# EAGLE design VNH2SP30 (EAGLE 7.2.0)
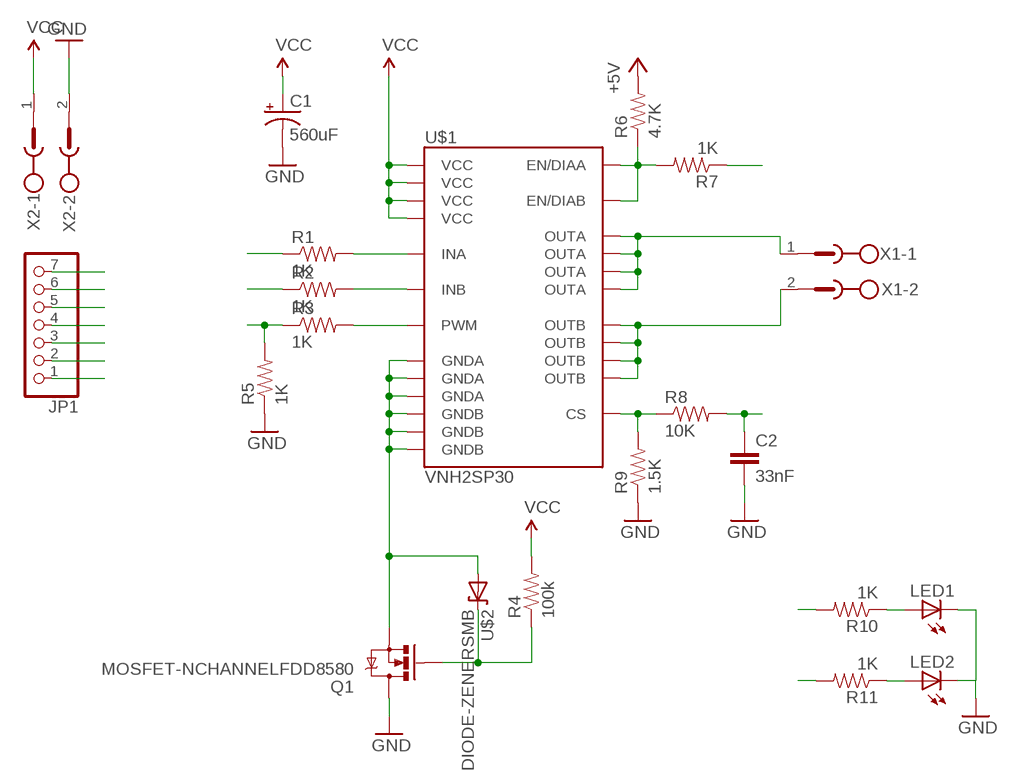
[diagram p0: schematic, sheet 1]

## Parts
C1  560uF  CAP_POLG  [PANASONIC_G]
C2  33nF  CAP1206  [1206]
JP1  PINHD-1X7  [1X07]
LED1  LEDCHIPLED_1206  [CHIPLED_1206]
LED2  LEDCHIPLED_1206  [CHIPLED_1206]
Q1  MOSFET-NCHANNELFDD8580  [DPAK]
R1  1K  RESISTOR1206  [1206]
R2  1K  RESISTOR1206  [1206]
R3  1K  RESISTOR1206  [1206]
R4  100k  RESISTOR1206  [1206]
R5  1K  RESISTOR1206  [1206]
R6  4.7K  RESISTOR1206  [1206]
R7  1K  RESISTOR1206  [1206]
R8  10K  RESISTOR1206  [1206]
R9  1.5K  RESISTOR1206  [1206]
R10  1K  RESISTOR1206  [1206]
R11  1K  RESISTOR1206  [1206]
U$1  VNH2SP30  [VNH2SP30]
U$2  DIODE-ZENERSMB  [SMB-DIODE]
X1  MSTBV2  [MSTBV2]
X2  MSTBV2  [MSTBV2]

## Nets
+5V: JP1.7 R6.2
CS: C2.1 JP1.2 R8.2
EN: JP1.6 R7.1
GND: C1.- C2.2 JP1.1 LED1.C LED2.C Q1.4(D) R5.1 R9.1 X2.2
INA: JP1.5 R1.1
INB: JP1.4 R2.1
N$2: Q1.3(S) U$1.18(GNDB) U$1.19(GNDB) U$1.20(GNDB) U$1.26(GNDA) U$1.27(GNDA) U$1.28(GNDA) U$2.A
N$3: R1.2 U$1.5(INA)
N$4: R2.2 U$1.11(INB)
N$5: R3.2 U$1.8(PWM)
N$6: Q1.1(G) R4.1 U$2.C
N$11: R8.1 R9.2 U$1.9(CS)
N$12: R6.1 R7.2 U$1.6(EN/DIAA) U$1.10(EN/DIAB)
N$32: LED2.A R11.1
N$34: LED1.A R10.1
OUTA: R11.2 U$1.1(OUTA) U$1.25(OUTA) U$1.30(OUTA) U$1.SLUG3(OUTA) X1.1
OUTB: R10.2 U$1.15(OUTB) U$1.16(OUTB) U$1.21(OUTB) U$1.SLUG2(OUTB) X1.2
PWM: JP1.3 R3.1 R5.2
VCC: C1.+ R4.2 U$1.3(VCC) U$1.13(VCC) U$1.23(VCC) U$1.SLUG1(VCC) X2.1

## Library data of the parts
C1 = SparkFun:CAP_POL: Capacitor Polarized These are standard SMD and PTH capacitors. Normally 10uF, 47uF, and 100uF in electrolytic and tantalum varieties. Always verify the external diameter of the through hole cap, it varies with capacity, voltage, and manufacturer. The EIA devices should be standard.
C2 = SparkFun:CAP: Capacitor Standard 0603 ceramic capacitor, and 0.1" leaded capacitor.
JP1 = pinhead:PINHD-1X7: PIN HEADER
LED1 LED2 = led:LED: LED OSRAM: - CHIPLED LG R971, LG N971, LY N971, LG Q971, LY Q971, LO R971, LY R971 LH N974, LH R974 LS Q976, LO Q976, LY Q976 LO Q996 - Hyper CHIPLED LW Q18S LB Q993, LB Q99A, LB R99A - SideLED LS A670, LO A670, LY A670, LG A670, LP A670 LB A673, LV A673, LT A673, LW A673 LH A674 LY A675 LS A676, LA A676, LO A676, LY A676, LW A676 LS A679, LY A679, LG A679 - Hyper Micro SIDELED® LS Y876, LA Y876, LO Y876, LY Y876 LT Y87S - SmartLED LW L88C, LW L88S LB L89C, LB L89S, LG L890 LS L89K, LO L89K, LY L89K LS L896, LA L896, LO L896, LY L896 - TOPLED LS T670, LO T670, LY T670, LG T670, LP T670 LSG T670, LSP T670, LSY T670, LOP T670, LYG T670 LG T671, LOG T671, LSG T671 LB T673, LV T673, LT T673, LW T673 LH T674 LS T676, LA T676, LO T676, LY T676, LB T676, LH T676, LSB T676, LW T676 LB T67C, LV T67C, LT T67C, LS T67K, LO T67K, LY T67K, LW E67C LS E67B, LA E67B, LO E67B, LY E67B, LB E67C, LV E67C, LT E67C LW T67C LS T679, LY T679, LG T679 LS T770, LO T770, LY T770, LG T770, LP T770 LB T773, LV T773, LT T773, LW T773 LH T774 LS E675, LA E675, LY E675, LS T675 LS T776, LA T776, LO T776, LY T776, LB T776 LHGB T686 LT T68C, LB T68C - Hyper Mini TOPLED® LB M676 - Mini TOPLED Santana® LG M470 LS M47K, LO M47K, LY M47K Source: http://www.osram.convergy.de LUXEON: - LUMILED® LXK2-PW12-R00, LXK2-PW12-S00, LXK2-PW14-U00, LXK2-PW14-V00 LXK2-PM12-R00, LXK2-PM12-S00, LXK2-PM14-U00 LXK2-PE12-Q00, LXK2-PE12-R00, LXK2-PE12-S00, LXK2-PE14-T00, LXK2-PE14-U00 LXK2-PB12-K00, LXK2-PB12-L00, LXK2-PB12-M00, LXK2-PB14-N00, LXK2-PB14-P00, LXK2-PB14-Q00 LXK2-PR12-L00, LXK2-PR12-M00, LXK2-PR14-Q00, LXK2-PR14-R00 LXK2-PD12-Q00, LXK2-PD12-R00, LXK2-PD12-S00 LXK2-PH12-R00, LXK2-PH12-S00 LXK2-PL12-P00, LXK2-PL12-Q00, LXK2-PL12-R00 Source: www.luxeon.com KINGBRIGHT: KA-3528ASYC Source: www.kingbright.com
Q1 = SparkFun:MOSFET-NCHANNEL
R1-R11 = SparkFun:RESISTOR: Resistor Basic schematic elements and footprints for 0603, 1206, and PTH 1/10th watt (small) resistors.
U$1 = SparkFun:VNH2SP30
U$2 = SparkFun:DIODE-ZENER: Zener Diode Production Part - 8199 3.4V Zener Voltage
X1 X2 = con-phoenix-500:MSTBV2: PHOENIX; OC_FARNELL: unknown; OC_NEWARK: unknown

## Board
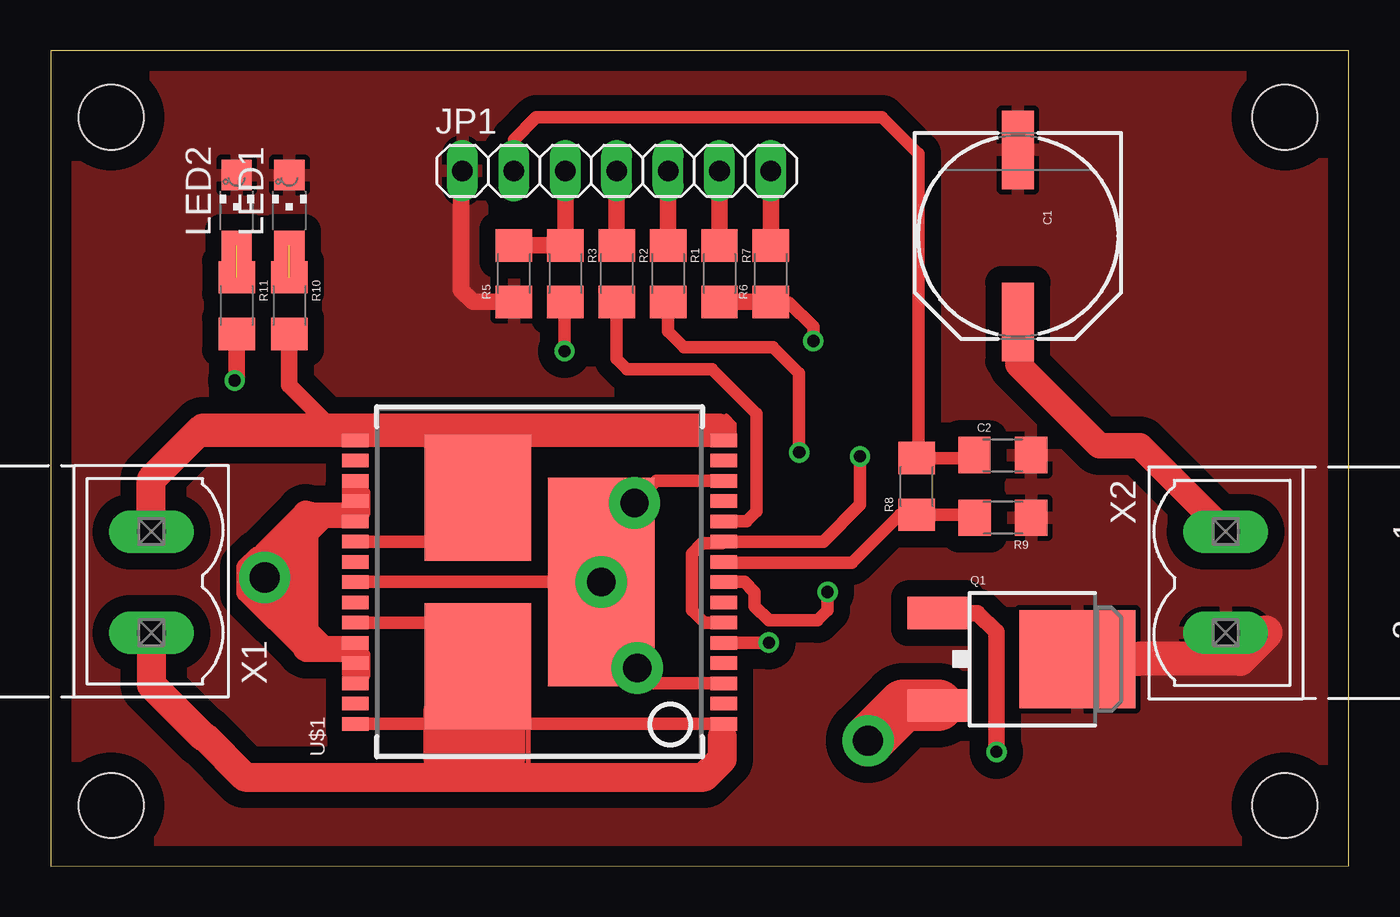
[diagram p1: board, top side]
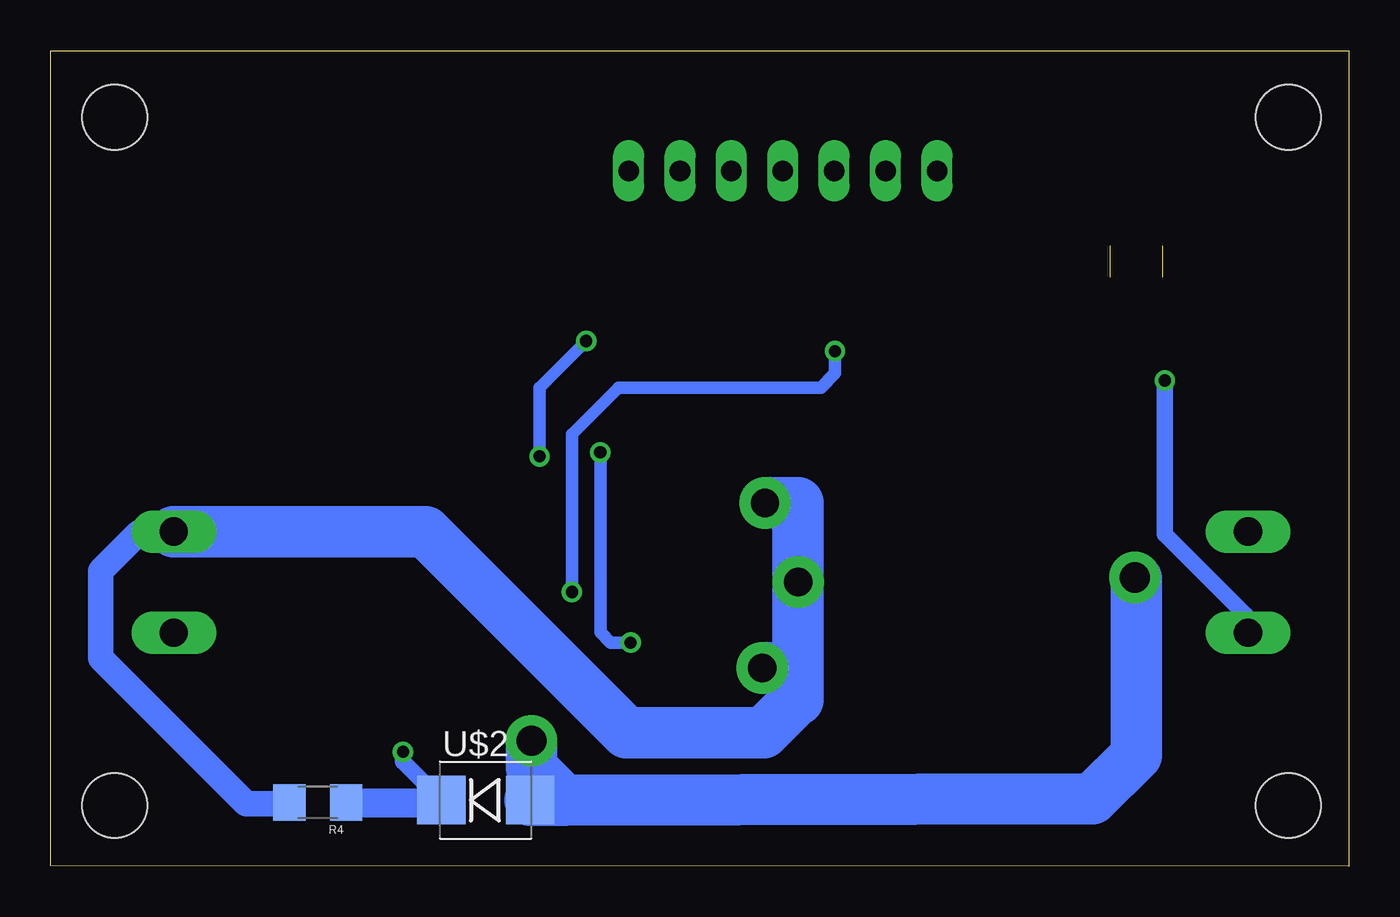
[diagram p2: board, bottom side, seen from below]

Size 64.17 x 40.3 mm. Coordinates in mm from the lower left corner, seen from the top.
Outline: 0,0 64.17,0.02 64.17,40.3 0,40.29 0,0
Copper layers (1*16): Top 0.035mm / dielectric 1.5mm / Bottom 0.035mm
Design rules "default": minimum track width 10mil, minimum drill 24mil, track to track 8mil, track to pad 8mil, pad to pad 8mil, via to via 8mil, smd to smd 8mil, copper to edge 40mil, drill to drill 8mil, minimum pad ring 10mil, minimum via ring 8mil, stop-mask expansion 4mil, vias tented up to drill 0mil, thermal gap 10mil
Holes 3.2 mm at 3,3 3,37 61,37 61,3

### Footprints (pad centres in the part's own frame; a part is rotated, then mirrored left to right if it is on the bottom)
PANASONIC_G = smd 3.9 x 1.6: + 4.25,0; - -4.25,0
1206 = smd 1.6 x 1.8: 1 -1.4,0; 2 1.4,0
1X07 = drill 1.016 long: 1 -7.62,0; 2 -5.08,0; 3 -2.54,0; 4 0,0; 5 2.54,0; 6 5.08,0; 7 7.62,0
CHIPLED_1206 = smd 1.5 x 1.5: A 0,-1.75; C 0,1.75
DPAK = smd 1.6 x 3: 1 -2.28,-5.31; 3 2.28,-5.31 | smd 4.826 x 5.715: 4 0,1.588
VNH2SP30 = smd 0.67 x 1.3: 1 -7,-9.1; 2 -6,-9.1; 3 -5,-9.1; 4 -4,-9.1; 5 -3,-9.1; 6 -2,-9.1; 7 -1,-9.1; 8 0,-9.1; 9 1,-9.1; 10 2,-9.1; 11 3,-9.1; 12 4,-9.1; 13 5,-9.1; 14 6,-9.1; 15 7,-9.1; 16 7,9.1; 17 6,9.1; 18 5,9.1; 19 4,9.1; 20 3,9.1; 21 2,9.1; 22 1,9.1; 23 0,9.1; 24 -1,9.1; 25 -2,9.1; 26 -3,9.1; 27 -4,9.1; 28 -5,9.1; 29 -6,9.1; 30 -7,9.1 | smd 10.3 x 5.25: SLUG1 0,-3.05 | smd 6.23 x 5.25: SLUG2 4.165,3.05; SLUG3 -4.165,3.05
SMB-DIODE = smd 2.4 x 2.4: A 2.2,0; C -2.2,0
MSTBV2 = drill 1.397 long: 1 -2.5,0; 2 2.5,0

### Placement (x,y rotation side)
C1  47.81,31.14 270 top
C2  47.06,20.31 0 top
JP1  27.98,34.36 0 top
LED1  11.8,32.4 0 top
LED2  9.2,32.4 0 top
Q1  49.16,10.23 270 top
R1  30.52,29.28 270 top
R2  27.98,29.28 270 top
R3  25.44,29.28 270 top
R4  50.96,3.15 180 bottom
R5  22.9,29.28 90 top
R6  35.6,29.28 90 top
R7  33.06,29.28 270 top
R8  42.8,18.77 90 top
R9  47.07,17.22 180 top
R10  11.8,27.7 270 top
R11  9.2,27.7 270 top
U$1  24.17,14.04 90 top
U$2  42.66,3.27 0 bottom
X1  4.98,14.04 90 top
X2  58.08,14.04 270 top

### Tracks (layer width: path | path; a pad name or v marks a point on that pad's centre or on a via)
+5V
  Top 0.813: JP1.7 R6.2
CS
  Top 0.61: JP1.2 22.9,35.9 24,37 41.1,37 42.9,35.2 42.9,20.27 R8.2 45.52,20.17 C2.1
EN
  Top 0.813: R7.1 JP1.6
GND
  Top 0.813: R5.1 20.87,27.88 20.3,28.45 20.3,34.3 JP1.1
  Top 1.676: X2.2 60.06,11.54 58.77,10.25 53.72,10.25 Q1.4
  pour Top (isolate 0.813): 0,0 0.03,40.39 64.11,40.39 64.08,0
INA
  Top 0.813: R1.1 JP1.5
INB
  Top 0.813: R2.1 JP1.4
N$2  (via drill 1.5 pad 2.54)
  Top 0.61: U$1.18 U$1.19 U$1.20 13.35,17.04 | U$1.26 15.07,10.53 U$1.27 U$1.28
  Top 1.016: 13.35,17.04 v10.58,14.27 10.58,13.81 13.54,10.85 14.75,10.85 15.07,10.53
  Top 2.54: v10.58,14.27 10.51,14.27 10.45,14.21 | Q1.3 42.15,7.95 v40.4,6.2
  Bottom 2.54: U$2.A 38.8,3.27 | 38.8,3.27 12.67,3.33 10.51,5.49 10.51,14.2 v10.58,14.27 | v40.4,6.2 40.4,4.87 38.8,3.27
N$3  (via drill 0.6)
  Top 0.61: R1.2 30.52,26.43 31.3,25.65 35.7,25.65 37,24.35 v37,20.45 | v35.5,11.05 U$1.5
  Bottom 0.61: v37,20.45 37,11.55 36.5,11.05 v35.5,11.05
N$4
  Top 0.61: R2.2 27.98,25.07 28.5,24.55 32.7,24.55 34.9,22.35 34.9,17.55 34.4,17.05 U$1.11
N$5  (via drill 0.6)
  Top 0.61: v25.4,25.45 25.4,27.84 R3.2 | v38.4,13.55 38.4,12.65 37.9,12.15 35.5,12.15 34.8,12.85 34.8,13.55 34.3,14.05 U$1.8
  Bottom 0.61: v25.4,25.45 25.4,24.35 26.1,23.65 36.1,23.65 38.4,21.35 v38.4,13.55
N$6  (via drill 0.6 pad 0.81)
  Top 0.813: Q1.1 45.82,12.51 46.75,11.58 v46.75,5.65
  Bottom 0.813: v46.75,5.65 46.75,5.16 U$2.C
  Bottom 1.422: R4.1 44.86,3.15 U$2.C
N$8
  Top 0.254: 7.6,20.85 33.6,20.85 33.8,21.05 33.8,21.85 33.4,22.25
N$9
  Top 0.254: 18.7,8.3 18.6,8.3 18.6,4.7
N$11
  Top 0.61: U$1.9 33.31,15 39.6,15 41.97,17.37 R8.1 45.52,17.37 R9.2
N$12  (via drill 0.6)
  Top 0.61: U$1.6 32.31,12.04 31.7,12.65 31.7,15.45 32.2,15.95 33.18,15.95 U$1.10 38.19,16.04 40,17.85 v40,20.25 | v37.7,25.95 37.7,26.65 36.5,27.85 35.63,27.85 R6.1
  Top 0.813: R7.2 R6.1
  Bottom 0.61: v40,20.25 40,23.65 v37.7,25.95
N$16
  Top 0.61: 15.5,18.45 15.5,17.45
N$17
  Top 0.61: 15.5,10.45 15.5,9.45
N$21
  Top 1.27: 12.6,17.45 12.6,10.75
N$22
  Top 1.27: 11.6,15.65 11.6,12.45
N$23
  Top 1.27: 10.7,15.15 10.7,13.55
N$24
  Top 1.27: 13.3,10.75 14.8,10.75
N$25
  Top 1.27: 15,17.35 12.9,17.35
N$26
  Top 1.27: 12.8,17.4 12.6,17.4 10.6,15.4 10.6,13 10.7,13 12.8,10.9
N$27
  Top 0.813: 14.8,9.5 14.8,10.3
N$28
  Top 0.813: 14.8,18.8 14.8,18.2
N$29
  Top 0.813: 14.9,10.5 12.6,10.5 9.6,13.5 9.6,14.8 10.2,15.4
N$30
  Top 0.254: 23.5,8.1 23.6,8.1 23.6,4.7
N$31
  Top 2.54: 19.7,7.6 19.7,5.4 22.2,5.4 22.2,6.8
N$32  (1 unrouted)
N$34  (1 unrouted)
OUTA  (via drill 0.6)
  Top 0.254: U$1.30 18.29,7.04 U$1.SLUG3
  Top 0.61: U$1.25 21.12,12.04 U$1.SLUG3 | U$1.30 U$1.1 33.27,6.47 33.2,6.4
  Top 0.813: R11.2 9.2,24.1 v9.1,24
  Top 1.422: X1.1 4.98,8.96 7.52,6.42 7.58,6.42 9.6,4.4 32.3,4.4 33.2,5.3 33.2,6.4
  Bottom 0.813: v9.1,24 9.1,16.4 5.1,12.4 5.1,11.66 X1.1
OUTB
  Top 0.254: 33.06,21.66 33.06,21.25 U$1.15 | U$1.16 18.29,21.04 U$1.SLUG2
  Top 0.61: U$1.16 U$1.15 | U$1.21 21.12,16.04 U$1.SLUG2
  Top 0.813: R10.2 11.8,23.76 13.9,21.66
  Top 1.422: X1.2 4.98,19.12 7.52,21.66 13.9,21.66 33.06,21.66
PWM
  Top 0.813: R5.2 R3.1 JP1.3
VCC  (via drill 1.4 pad 2.54)
  Top 0.61: U$1.SLUG1 24.97,14.04 24.96,14.05 U$1.23 | U$1.3 29.75,9.04 v28.99,9.8 | U$1.13 29.95,19.04 v28.86,17.95
  Top 1.27: C1.+ 47.81,24.81 51.84,20.78 53.84,20.78 X2.1
  Top 2.54: U$1.SLUG1 25.89,14.04 25.89,13.96
  Bottom 1.27: X2.1 58.15,16.47 59.81,16.47 61.68,14.6 61.68,10.28 54.5,3.1 52.41,3.1 R4.2
  Bottom 2.54: X2.1 45.64,16.54 35.7,6.6 28.95,6.6 28.94,6.59 27.31,8.22 27.22,8.22 27.22,9.74 | 27.22,9.74 U$1.SLUG1 27.22,17.95 v28.86,17.95 | v28.99,9.8 27.28,9.8 27.22,9.74
  other vias: 27.22,14.04